# EAGLE design ETAG_v6 (EAGLE 7.5.0)

## Sheet 1 of 2
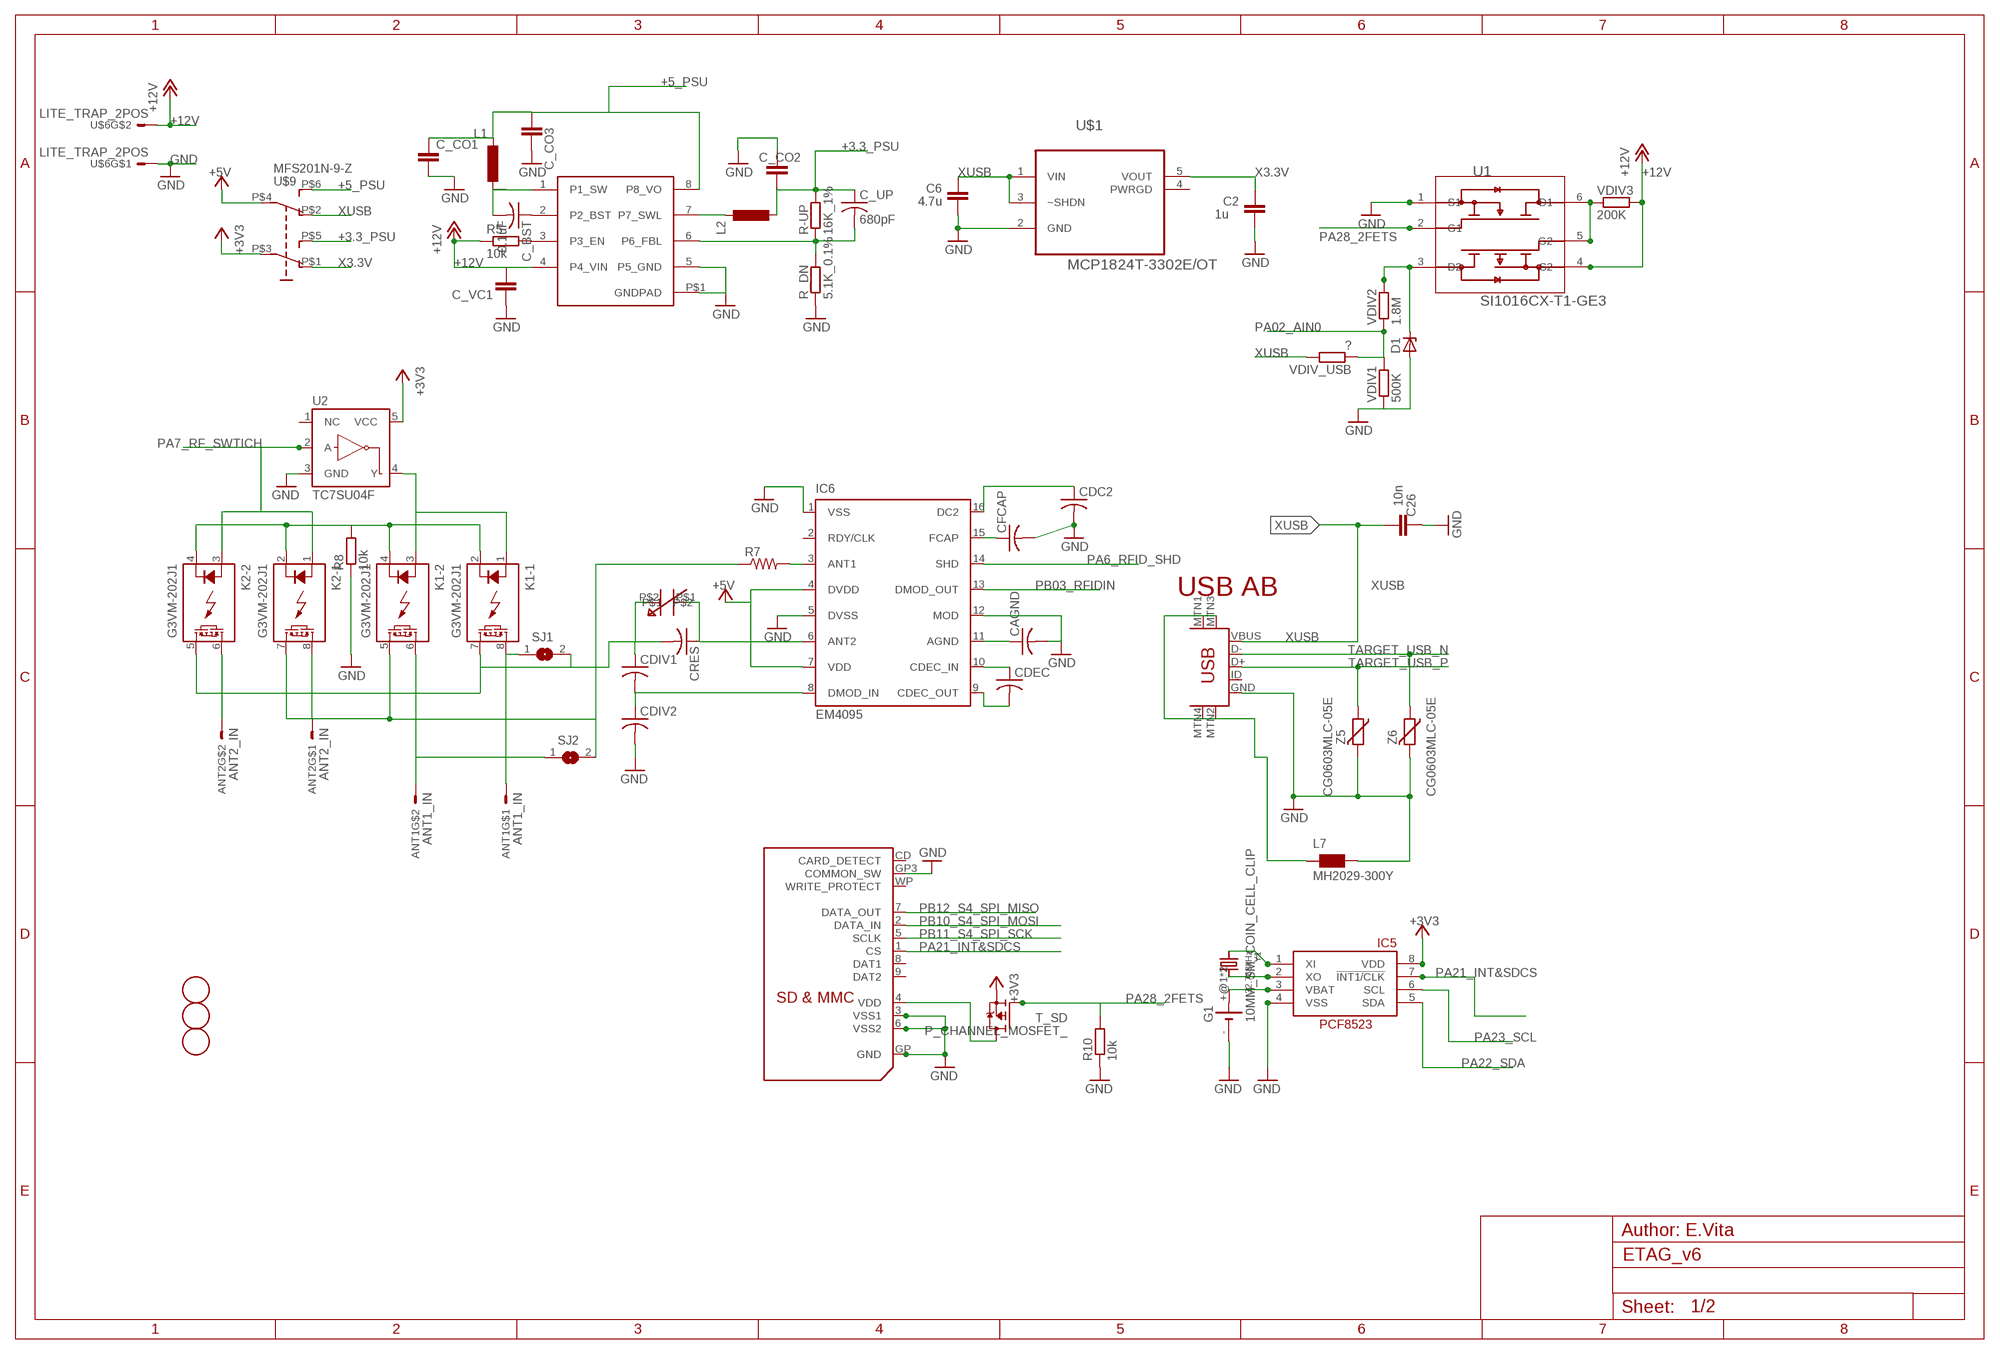
[diagram p0: schematic, sheet 1]

### Parts
ANT1  ANT1_IN  LITE_TRAP_2POS  [LITE_TRAP_MINI]
ANT2  ANT2_IN  LITE_TRAP_2POS  [LITE_TRAP_MINI]
C2  1u  0142_10NF_0603  [C0603-ROUND]
C6  4.7u  0142_10NF_0603  [C0603-ROUND]
C26  10n  0142_10NF_0603  [C0603-ROUND]
C_BST  0.1uF  C-US  [C0603-ROUND]
C_CO1  22uF  C-EUC0805  [C0805]
C_CO2  22uF  C-EUC0805  [C0805]
C_CO3  10uF  C-EUC0805  [C0805]
C_UP  680pF  C-US  [C0603-ROUND]
C_VC1  10uF  C-EUC1210  [C1210]
CAGND  C-US  [C0603-ROUND]
CDC2  C-US  [C0603-ROUND]
CDEC  C-US  [C0603-ROUND]
CDIV1  C-USC1206K  [C1206K]
CDIV2  C-USC1206K  [C1206K]
CFCAP  C-US  [C0603-ROUND]
CRES  C-USC1206K  [C1206K]
D1  ZENER-DIODESOD123  [SOD123FL]
FD1  FIDUCIALMOUNT  [FIDUCIA-MOUNT]
FD2  FIDUCIALMOUNT  [FIDUCIA-MOUNT]
FD3  FIDUCIALMOUNT  [FIDUCIA-MOUNT]
G1  10MM_SM_COIN_CELL_CLIP  [10MM_SM_COIN_CELL_CLIP]
IC5  RTC_PCF8523T  [SOIC8_150MIL]
IC6  EM4095  [SO16]
K1  G3VM-202J1  AQW21SOP  [SOP08]
K2  G3VM-202J1  AQW21SOP  [SOP08]
L1  22uH  L-EUSLF_10MM  [SLF10165]
L2  2.2uH  L-EU1008  [L1008(2520METRIC)]
L7  MH2029-300Y  0001_BLM21PG300SN1D_/_MH2029-300Y  [0805]
R5  10k  0028_CR0603JW103L  [R0603-ROUND]
R7  R-US_R1206  [R1206]
R8  10k  0028_CR0603JW103L  [R0603-ROUND]
R10  10k  0028_CR0603JW103L  [R0603-ROUND]
R-UP  16K_1%  2022_CR0603FW104L  [R0603-ROUND]
R_DN  5.1K_0.1%  2339_  [R0603-ROUND]
SJ1  SJW  [SJW]
SJ2  SJW  [SJW]
T_SD  P_CHANNEL_MOSFET_  [SOT23]
U1  SI1016CX-T1-GE3  [SOT50P162X60-6N]
U2  TC7SU04F  INVERTER_SOT23-5  [SOT23-5]
U$1  MCP1824T-3302E/OT  [SOT95P270X145-5N]
U$3  BD93291EFJSOP8_W_GND  [SOP08_GNDPAD]
U$4  SDMMC06132  [06132]
U$5  USB-MINIB-5PIN  [USB-MINIB]
U$6  LITE_TRAP_2POS  [LITE_TRAP_MINI]
U$9  MFS201N-9-Z  [MFS201N-9-Z]
VAR_C  TZB4Z100AB10R00  [TZB4Z100AB10R00]
VDIV1  500K  2339_  [R0603-ROUND]
VDIV2  1.8M  2022_CR0603FW104L  [R0603-ROUND]
VDIV3  200K  2022_CR0603FW104L  [R0603-ROUND]
VDIV_USB  ?  2339_  [R0603-ROUND]
Y1  32.768kHz  CRYSTAL8.0X3.8  [CRYSTAL_8X3.8]
Z5  CG0603MLC-05E  0010_BRNCG0603MLC-05E  [CT/CN0603]
Z6  CG0603MLC-05E  0010_BRNCG0603MLC-05E  [CT/CN0603]

### Nets
2GND [gnd]: L7.1 U$5.MTN1(MTN2) U$5.MTN2(MTN3) U$5.MTN3(MTN1) U$5.MTN4
+3.3_PSU: C_CO2.2 C_UP.1 L2.2 R-UP.2 U$9.P$5(S)
+3V3: IC5.8(VDD) T_SD.2(S) U2.5(VCC) U$9.P$3(P) ; also sheet 2
+5_PSU [usbvcc]: C_CO1.1 C_CO3.1 L1.P$1 U$3.8(P8_VO) U$9.P$6(S1)
+5V [usbvcc]: IC6.4(DVDD) IC6.7(VDD) U$9.P$4(P1) ; also sheet 2
+12V: C_VC1.2 R5.1 U1.4(S2) U$3.4(P4_VIN) U$6.P$3 U$6.P$4 VDIV3.2 ; also sheet 2
GND [gnd]: C2.1 C6.1 C26.2 C_CO1.2 C_CO2.1 C_CO3.2 C_VC1.1 CAGND.2 CDC2.2 CDIV2.2 CFCAP.2 D1.A G1.- IC5.4(VSS) IC6.1(VSS) IC6.5(DVSS) IC6.12(MOD) L7.2 R8.1 R10.1 R_DN.1 U1.1(S1) U2.3(GND) U$1.2(GND) U$3.5(P5_GND) U$3.P$1(GNDPAD) U$4.3(VSS1) U$4.6(VSS2) U$4.GP3(COMMON_SW) U$4.GP(GND) U$5.GND U$6.P$1 U$6.P$2 VDIV1.1 Z5.2 Z6.2 ; also sheet 2
N$2: IC5.2(XO) Y1.P$4
N$3: IC5.1(XI) Y1.P$1
N$4: CFCAP.1 IC6.15(FCAP)
N$5: CAGND.1 IC6.11(AGND)
N$6: C_BST.1 U$3.2(P2_BST)
N$7: C_UP.2 R-UP.1 R_DN.2 U$3.6(P6_FBL)
N$8: R5.2 U$3.3(P3_EN)
N$9: K1.5(-2:D2) K2.7(-1:D2) R7.1 SJ2.2
N$11: CDIV1.1 CRES.2 K1.7(-1:D2) K2.5(-2:D2) SJ1.2 VAR_C.P$2
N$12: CRES.1 IC6.6(ANT2) VAR_C.P$1
N$13: CDIV1.2 CDIV2.1 IC6.8(DMOD_IN)
N$14: ANT1.P$1 ANT1.P$2 K1.8(-1:D1) SJ1.1
N$15: U1.5(G2) U1.6(D1) VDIV3.1
N$16: ANT2.P$1 ANT2.P$2 K2.8(-1:D1)
N$17: CDC2.1 IC6.16(DC2)
N$18: CDEC.2 IC6.9(CDEC_OUT)
N$19: CDEC.1 IC6.10(CDEC_IN)
N$20: IC6.3(ANT1) R7.2
N$21: D1.C U1.3(D2) VDIV2.2
N$22 [gnd]: K1.2(-1:K) K1.4(-2:K) K2.2(-1:K) K2.4(-2:K) R8.2
N$26: L2.1 U$3.7(P7_SWL)
N$27: C_BST.2 L1.P$2 U$3.1(P1_SW)
N$30: ANT2.P$3 ANT2.P$4 K2.6(-2:D1)
N$32: K1.1(-1:A) K1.3(-2:A) U2.4(Y)
N$35: ANT1.P$3 ANT1.P$4 K1.6(-2:D1) SJ2.1
PA02_AIN0: VDIV1.2 VDIV2.1 VDIV_USB.1 ; also sheet 2
PA6_RFID_SHD: IC6.14(SHD)
PA7_RF_SWTICH: K2.1(-1:A) K2.3(-2:A) U2.2(A) ; also sheet 2
PA21_INT&SDCS: IC5.7(!INT1/CLK) U$4.1(CS) ; also sheet 2
PA22_SDA: IC5.5(SDA) ; also sheet 2
PA23_SCL: IC5.6(SCL) ; also sheet 2
PA28_2FETS: R10.2 T_SD.1(G) U1.2(G1) ; also sheet 2
PB03_RFIDIN: IC6.13(DMOD_OUT) ; also sheet 2
PB10_S4_SPI_MOSI: U$4.2(DATA_IN) ; also sheet 2
PB11_S4_SPI_SCK: U$4.5(SCLK) ; also sheet 2
PB12_S4_SPI_MISO: U$4.7(DATA_OUT) ; also sheet 2
TARGET_USB_N [USBpair]: U$5.D- Z6.1 ; also sheet 2
TARGET_USB_P [USBpair]: U$5.D+ Z5.1 ; also sheet 2
VBAT1: G1.+@1(+) G1.+@2(+) IC5.3(VBAT)
VDD: T_SD.3(D) U$4.4(VDD)
X3.3V: C2.2 U$1.5(VOUT) U$9.P$1(O)
XUSB [usbvcc]: C6.2 C26.1 U$1.1(VIN) U$1.3(~SHDN) U$5.VBUS U$9.P$2(O1) VDIV_USB.2
Unconnected: IC6.2(RDY/CLK) U2.1(NC) U$1.4(PWRGD) U$4.8(DAT1) U$4.9(DAT2) U$4.CD(CARD_DETECT) U$4.WP(WRITE_PROTECT) U$5.ID

### Notes on the sheet
- USB AB
- Author: E.Vita

## Sheet 2 of 2
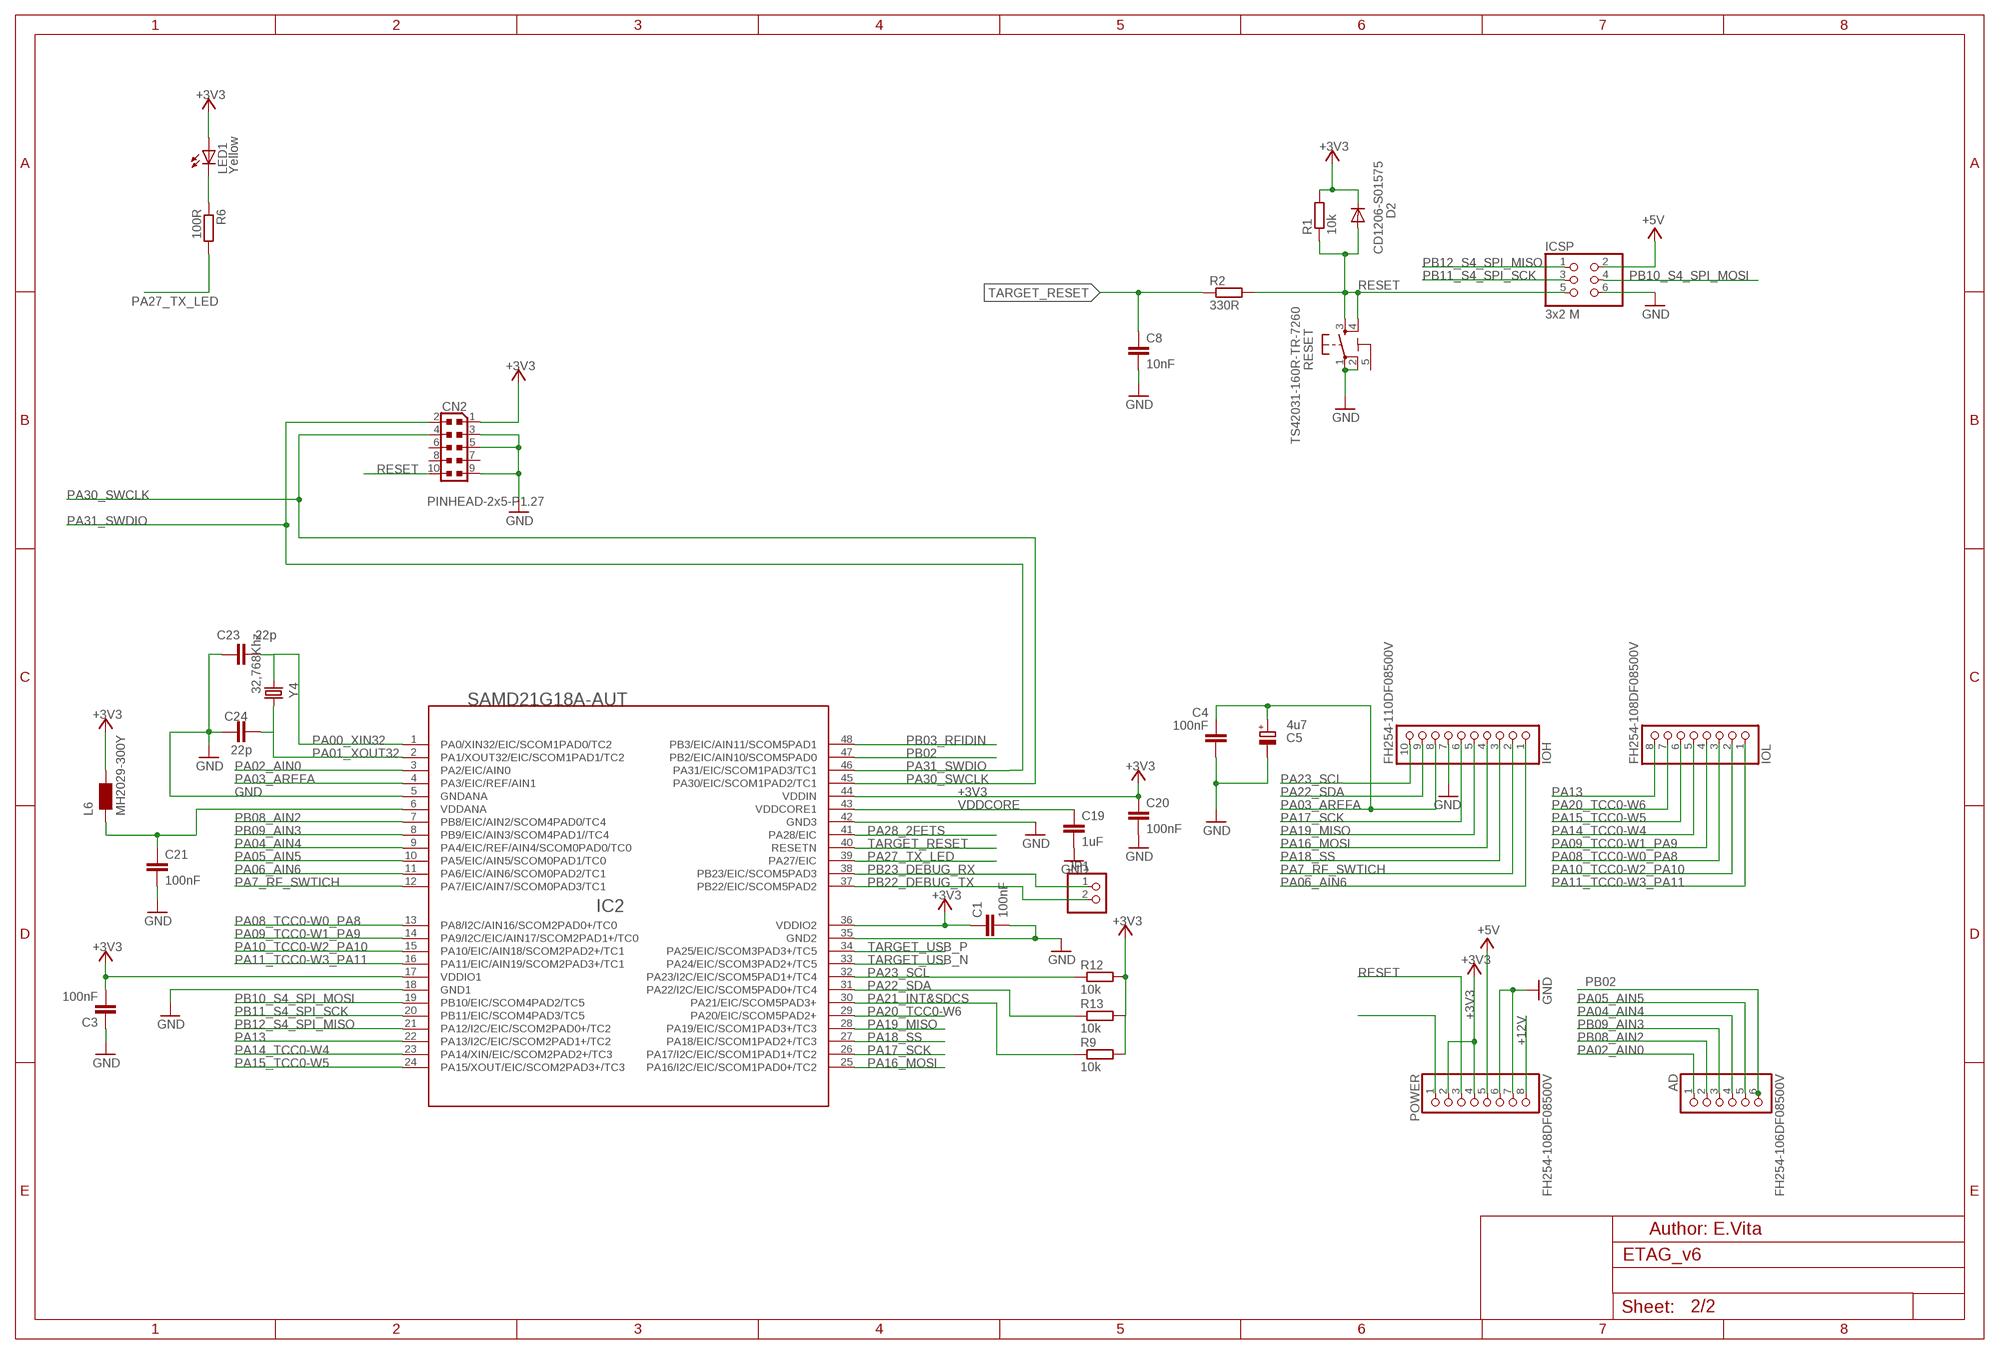
[diagram p1: schematic, sheet 2]

### Parts
AD  FH254-106DF08500V  1682_20TW-535_STD  [1X06]
C1  100nF  0015_100NF_0603  [C0603-ROUND]
C3  100nF  0015_100NF_0603  [C0603-ROUND]
C4  100nF  0015_100NF_0603  [C0603-ROUND]
C5  4u7  0474_TAJA475M016RNJ  [SMC_A]
C8  10nF  0142_10NF_0603  [C0603-ROUND]
C19  1uF  0006_1UF_0603/GRM188R61E105KA12D  [C0603-ROUND]
C20  100nF  0015_100NF_0603  [C0603-ROUND]
C21  100nF  0015_100NF_0603  [C0603-ROUND]
C23  22p  0014_22PF_0603  [C0603-ROUND]
C24  22p  0014_22PF_0603  [C0603-ROUND]
CN2  PINHEAD-2x5-P1.27  0171_PH127-205DF055G00AROUND-PADS  [PINHEAD_2X05_127]
D2  CD1206-S01575  0012_CD1206-S01575  [MINIMELF]
IC2  SAMD21G18A-AUT  1792_SAMD21G18A-AUT  [TQFP48-7X7]
ICSP  3x2 M  0114_PH254-203DF118A00V  [2X03]
IOH  FH254-110DF08500V  1684_20TW-537  [1X10]
IOL  FH254-108DF08500V  1683_20TW-536  [1X08]
JP1  PINHD-1X2  [1X02]
L6  MH2029-300Y  0001_BLM21PG300SN1D_/_MH2029-300Y  [0805]
LED1  Yellow  0044_KPT-2012YC  [CHIPLED_0805]
POWER  FH254-108DF08500V  1683_20TW-536  [1X08]
R1  10k  0028_CR0603JW103L  [R0603-ROUND]
R2  330R  0049_330R_0603  [R0603-ROUND]
R6  100R  0233_0R_0603  [R0603-ROUND]
R9  10k  0028_CR0603JW103L  [R0603-ROUND]
R12  10k  0028_CR0603JW103L  [R0603-ROUND]
R13  10k  0028_CR0603JW103L  [R0603-ROUND]
RESET  TS42031-160R-TR-7260  0946_TS42031-160W-TR-7260  [TS42]
Y4  32,768Khz  0213_ABS07-32.768KHZ-T  [RESONATOR_EPSON_FC_145]

### Nets
+3V3: C1.1 C3.2 C20.1 CN2.1 D2.C IC2.17(VDDIO1) IC2.36(VDDIO2) IC2.44(VDDIN) L6.2 LED1.A POWER.2 POWER.4 R1.2 R9.2 R12.2 R13.2 ; also sheet 1
+5V [usbvcc]: ICSP.2 POWER.5 ; also sheet 1
+12V: POWER.8 ; also sheet 1
GND [gnd]: C1.2 C3.1 C4.2 C5.- C8.2 C19.2 C20.2 C21.2 C23.1 C24.1 CN2.3 CN2.5 CN2.9 IC2.5(GNDANA) IC2.18(GND1) IC2.35(GND2) IC2.42(GND3) ICSP.6 IOH.7 POWER.6 POWER.7 RESET.1 RESET.2 ; also sheet 1
N$1: LED1.C R6.1
N$10: C21.1 IC2.6(VDDANA) L6.1
N$56: POWER.1
PA00_XIN32: C23.2 IC2.1(PA0/XIN32/EIC/SCOM1PAD0/TC2) Y4.P$1
PA01_XOUT32: C24.2 IC2.2(PA1/XOUT32/EIC/SCOM1PAD1/TC2) Y4.P$2
PA02_AIN0: AD.1 IC2.3(PA2/EIC/AIN0) ; also sheet 1
PA03_AREFA: C4.1 C5.+ IC2.4(PA3/EIC/REF/AIN1) IOH.8
PA04_AIN4: AD.4 IC2.9(PA4/EIC/REF/AIN4/SCOM0PAD0/TC0)
PA05_AIN5: AD.5 IC2.10(PA5/EIC/AIN5/SCOM0PAD1/TC0)
PA06_AIN6: IC2.11(PA6/EIC/AIN6/SCOM0PAD2/TC1) IOH.1
PA7_RF_SWTICH: IC2.12(PA7/EIC/AIN7/SCOM0PAD3/TC1) IOH.2 ; also sheet 1
PA08_TCC0-W0_PA8: IC2.13(PA8/I2C/AIN16/SCOM2PAD0+/TC0) IOL.3
PA09_TCC0-W1_PA9: IC2.14(PA9/I2C/EIC/AIN17/SCOM2PAD1+/TC0) IOL.4
PA10_TCC0-W2_PA10: IC2.15(PA10/EIC/AIN18/SCOM2PAD2+/TC1) IOL.2
PA11_TCC0-W3_PA11: IC2.16(PA11/EIC/AIN19/SCOM2PAD3+/TC1) IOL.1
PA13: IC2.22(PA13/I2C/EIC/SCOM2PAD1+/TC2) IOL.8
PA14_TCC0-W4: IC2.23(PA14/XIN/EIC/SCOM2PAD2+/TC3) IOL.5
PA15_TCC0-W5: IC2.24(PA15/XOUT/EIC/SCOM2PAD3+/TC3) IOL.6
PA16_MOSI: IC2.25(PA16/I2C/EIC/SCOM1PAD0+/TC2) IOH.4
PA17_SCK: IC2.26(PA17/I2C/EIC/SCOM1PAD1+/TC2) IOH.6
PA18_SS: IC2.27(PA18/EIC/SCOM1PAD2+/TC3) IOH.3
PA19_MISO: IC2.28(PA19/EIC/SCOM1PAD3+/TC3) IOH.5
PA20_TCC0-W6: IC2.29(PA20/EIC/SCOM5PAD2+) IOL.7
PA21_INT&SDCS: IC2.30(PA21/EIC/SCOM5PAD3+) R9.1 ; also sheet 1
PA22_SDA: IC2.31(PA22/I2C/EIC/SCOM5PAD0+/TC4) IOH.9 R13.1 ; also sheet 1
PA23_SCL: IC2.32(PA23/I2C/EIC/SCOM5PAD1+/TC4) IOH.10 R12.1 ; also sheet 1
PA27_TX_LED: IC2.39(PA27/EIC) R6.2
PA28_2FETS: IC2.41(PA28/EIC) ; also sheet 1
PA30_SWCLK: CN2.4 IC2.45(PA30/EIC/SCOM1PAD2/TC1)
PA31_SWDIO: CN2.2 IC2.46(PA31/EIC/SCOM1PAD3/TC1)
PB02: AD.6 IC2.47(PB2/EIC/AIN10/SCOM5PAD0)
PB03_RFIDIN: IC2.48(PB3/EIC/AIN11/SCOM5PAD1) ; also sheet 1
PB08_AIN2: AD.2 IC2.7(PB8/EIC/AIN2/SCOM4PAD0/TC4)
PB09_AIN3: AD.3 IC2.8(PB9/EIC/AIN3/SCOM4PAD1//TC4)
PB10_S4_SPI_MOSI: IC2.19(PB10/EIC/SCOM4PAD2/TC5) ICSP.4 ; also sheet 1
PB11_S4_SPI_SCK: IC2.20(PB11/EIC/SCOM4PAD3/TC5) ICSP.3 ; also sheet 1
PB12_S4_SPI_MISO: IC2.21(PA12/I2C/EIC/SCOM2PAD0+/TC2) ICSP.1 ; also sheet 1
PB22_DEBUG_TX: IC2.37(PB22/EIC/SCOM5PAD2) JP1.2
PB23_DEBUG_RX: IC2.38(PB23/EIC/SCOM5PAD3) JP1.1
RESET: CN2.10 D2.A ICSP.5 POWER.3 R1.1 R2.2 RESET.3 RESET.4
TARGET_RESET: C8.1 IC2.40(RESETN) R2.1
TARGET_USB_N [USBpair]: IC2.33(PA24/EIC/SCOM3PAD2+/TC5) ; also sheet 1
TARGET_USB_P [USBpair]: IC2.34(PA25/EIC/SCOM3PAD3+/TC5) ; also sheet 1
VDDCORE: C19.1 IC2.43(VDDCORE1)
Unconnected: CN2.6 CN2.7 CN2.8

### Notes on the sheet
- Author: E.Vita

## Power pins joined to a net without a drawn wire
5-GND: RESET.5(5-GND)

## Library data of the parts
AD = Connettori:1682_20TW-535: Female Gray Connector strip for Arduino 3V3 bases - 6x1 F V h 8,5 p2,54; MONTHLY_USAGE: 86722.85; PART_NUMBER: 20TW-535; PRICE: _0.03; SUPPLIER: CBC_elettronica__s.r.l.; TYPE: Connettori
ANT1 ANT2 U$6 = con-molex:LITE_TRAP_2POS
C1 C3 C4 C20 C21 = Condensatori:0015_100NF_0603: 100nF 0603 50V; CASE: 0603; MONTHLY_USAGE: _____; PART_NUMBER: cl10b104kbnc; PRICE: _____; SUPPLIER: _____; TYPE: Condensatori
C2 C6 C26 = Condensatori:0142_10NF_0603: 10nF 0603; CASE: 0603; MONTHLY_USAGE: _____; PART_NUMBER: 10nF_0603; PRICE: _____; SUPPLIER: _____; TYPE: Condensatori; VALUE: 10nF
C5 = Condensatori:0474_TAJA475M016RNJ: 4u7 tantalio Case A - testa gialla -Tantalio; CASE: CaseA_(1206); MONTHLY_USAGE: _____; PART_NUMBER: TAJA475M016RNJ; PRICE: _____; SUPPLIER: _____; TYPE: Condensatori
C8 = Condensatori:0142_10NF_0603: 10nF 0603; CASE: 0603; MONTHLY_USAGE: _____; PART_NUMBER: 10nF_0603; PRICE: _____; SUPPLIER: _____; TYPE: Condensatori
C19 = Condensatori:0006_1UF_0603/GRM188R61E105KA12D: 1uF 0603; CASE: 0603; MONTHLY_USAGE: _____; PART_NUMBER: 1uF_0603/GRM188R61E105KA12D; PRICE: _____; SUPPLIER: _____; TYPE: Condensatori
C23 C24 = Condensatori:0014_22PF_0603: 22pF 0603; CASE: 0603; MONTHLY_USAGE: _____; PART_NUMBER: 22pF_0603; PRICE: _____; SUPPLIER: _____; TYPE: Condensatori
C_BST C_UP CAGND CDC2 CDEC CDIV1 CDIV2 CFCAP CRES = rcl:C-US: CAPACITOR, American symbol
C_CO1-C_CO3 C_VC1 = rcl:C-EU: CAPACITOR, European symbol
CN2 = Connettori:0171_PH127-205DF055G00A: 2x5 PASSO 1,27
D1 = diode:ZENER-DIODE: Z-Diode
D2 = Diodi:0012_CD1206-S01575: small-signal high-speed Switching Diodes CD1206; CASE: 1206; MONTHLY_USAGE: _____; PART_NUMBER: CD1206-S01575; PRICE: _____; SUPPLIER: _____; TYPE: Diodi
FD1-FD3 = SmartPrj:FIDUCIALMOUNT
G1 = battery:10MM_SM_COIN_CELL_CLIP: Battery cell clip for CR927 Source: KEYSTONE ELECTRONICS CORP. www.keyelco.com, ASTORIA, N.Y. 11105-2017 PART ANME 10mm SM COIN CELl CLIP DWG NO. 3030
IC2 = IntegratedCircuits:1792_SAMD21G18A-AUT: Atmel D21 32bit ARM Cortex-M0 microcontroller - 48 PIN TQFP 256KB flash memory + 32KB SRAM
IC5 = microbuilder:RTC_PCF8523
IC6 = em-microelectronic:EM4095: Read/Write analog front end for 125kHz RFID Basestation Source: http://www.emmicroelectronic.com/webfiles/Product/RFID/DS/EM4095_DS.pdf
ICSP = Connettori:0114_PH254-203DF118A00V: 3x2 M V h 8,5 mm p2,54; MONTHLY_USAGE: _____; PART_NUMBER: PH254-203DF118A00V; PRICE: _____; SUPPLIER: _____; TYPE: Connettori; VALUE: ICSP
IOH = Connettori:1684_20TW-537: Female Gray Connector strip for Arduino 3V3 bases - 10x1 F V h 8,5 p2,54mm; MONTHLY_USAGE: _____; PART_NUMBER: 20TW-537; PRICE: _____; SUPPLIER: _____; TYPE: Connettori
IOL POWER = Connettori:1683_20TW-536: Female Gray Connector strip for Arduino 3V3 bases - 8x1 F V h 8,5 p2,54mm; MONTHLY_USAGE: _____; PART_NUMBER: 20TW-536; PRICE: _____; SUPPLIER: _____; TYPE: Connettori
JP1 = pinhead:PINHD-1X2: PIN HEADER
K1 K2 = relay:AQW*: PhotoMOS Relay NAiS Source: http://www.mew-europe.com/.. pti_en.pdf; OC_FARNELL: unknown; OC_NEWARK: unknown
L1 L2 = rcl:L-EU: INDUCTOR, European symbol
L6 L7 = Protezione:0001_BLM21PG300SN1D_/_MH2029-300Y: BLM21; MONTHLY_USAGE: _____; PART_NUMBER: BLM21PG300SN1D_/_MH2029-300Y; PRICE: _____; SUPPLIER: _____; TYPE: Protezione
LED1 = Opto:0044_KPT-2012YC: LED YELLOW - SMD - 0805; MONTHLY_USAGE: _____; PART_NUMBER: KPT-2012YC; PRICE: _____; SUPPLIER: _____; TYPE: Opto
R1 R5 R8-R10 R12 R13 = Resistenze:0028_CR0603JW103L: 10K 0603; CASE: 0603; MONTHLY_USAGE: _____; PART_NUMBER: CR0603JW103L; PRICE: _____; SUPPLIER: _____; TYPE: Resistenze
R2 = Resistenze:0049_330R_0603: 330R 0603; CASE: 0603; MONTHLY_USAGE: _____; PART_NUMBER: 330R_0603; PRICE: _____; SUPPLIER: _____; TYPE: Resistenze
R6 = Resistenze:0233_0R_0603: 0R 0603; CASE: 0603; MONTHLY_USAGE: _____; PART_NUMBER: 0R_0603; PRICE: _____; SUPPLIER: _____; TYPE: Resistenze; VALUE: 0R
R7 = rcl:R-US_: RESISTOR, American symbol
R-UP VDIV2 VDIV3 = Resistenze:2022_CR0603FW104L: 0603 Resistor 100K 1%; PART_NUMBER: CR0603FW104L; VALUE: 100K_1%
R_DN VDIV1 VDIV_USB = Resistenze:2339_: 19K1 0,1% 0603; CASE: 0603; MONTHLY_USAGE: _____; PRICE: _____; SUPPLIER: _____; TYPE: Resistenze; VALUE: 19K1_0,1%
RESET = Switches:0946_TS42031-160W-TR-7260: Pushbutton 6x6 Smd - White; MONTHLY_USAGE: _____; PART_NUMBER: IT-1157AHNP-160G-G_GTR; PRICE: _____; SUPPLIER: _____; TYPE: Switches; VALUE: TS42
SJ1 SJ2 = jumper:SJ: SMD solder JUMPER
T_SD = transistor-fet:P_CHANNEL_MOSFET_
U1 = Vishay_By_element14_Batch_1:SI1016CX-T1-GE3: Complementary N- and P-Channel 20 V (D-S) MOSFET; MPN: SI1016CX-T1-GE3; OC_FARNELL: 2056711; OC_NEWARK: 64T4049; PACKAGE: SOT-5; SUPPLIER: VISHAY SILICONIX
U2 = SparkFun-DigitalIC:INVERTER: Single inverter, SOT23-5; NOTE: RETIRED; PROD_ID: 8211
U$1 = Microchip_By_element14_Batch_1:MCP1824T-3302E/OT: 300 mA, Low Voltage, Low Quiescent Current LDO Regulator; MPN: MCP1824T-3302E/OT; OC_FARNELL: 1578387; OC_NEWARK: 40M0704; PACKAGE: SOT23-5; SUPPLIER: Microchip
U$3 = v-reg:BD93291EFJ: BD93291EFJ Voltage regulator
U$4 = microbuilder:SDMMC: SD MMC Card holder 4UCON part #06132 - easy to solder
U$5 = USB_miniB:USB-MINIB
U$9 = switch:MFS201N-9-Z
VAR_C = mylibrary:TZB4Z100AB10R00
Y1 = microbuilder:CRYSTAL: Crystals HC49UP - Surface Mount Crystal 4.0MHz 18pF +/-30ppm Surface Mount Crystal [Digikey: 535-9857-1-ND] 12.0 MHz Surface Mount Crystal [Digikey: 535-9869-6-ND] 25.0 MHz Surface Mount Crystal [Digikey: 535-9078-1-ND] 2.5 x 2.0mm - MEMs SMT Crystal 16.0 MHz 10pF 20ppm 2.5 x 2.0mm Crystal [Digikey -40-85°C: 535-10923-1-ND] 3.2 x 2.5mm - MEMs SMT Crystal 12.0 MHz 8pF 15ppm 3.2 x 2.5mm Crystal [Digikey: -10-70°C: 644-1047-1-ND -40-125°C: 644-1128-1-ND] 40~85°C cheaper: 644-1173-6-ND 16.0 MHz 8pF 15ppm 3.2 x 2.5mm Crystal [Digikey: -10-70°C: 644-1049-1-ND -40-125°C: 644-1129-2-ND]-40~85°C cheaper: 644-1175-6-ND 16.0 MHz 10pF 10ppm 3.2 x 2.5mm Crystal [Digikey: 644-1100-1-ND] 27.12 MHz 18pF 30ppm 3.2 x 2.5mm Crystal [Digikey: 887-1424-1-ND] 27.12MHz 10pF 10ppm 3.2 x 2.5mm Crystal [Digikey: 887-1329-1-ND] 4.9 x 1.8mm - MEMs SMT Crystal 32.768 KHz 12.5pF 20ppm 4.9 x 1.8mm Crystal [Digikey: SE2415CT-ND] 8.0 x 3.8mm - Surface Mount Crystal 32.768kHz 12.5pF 20ppm -40°C-85°C [Digikey: 535-9166-2-ND] Cylinder 32.768KHz Cylinder Crystal (2x6mm body) [Ex. Digikey: 300-8341-2-ND]
Y4 = Cristalli:0213_ABS07-32.768KHZ-T: 32,768KHz - SMD; MONTHLY_USAGE: _____; PART_NUMBER: ABS07-32.768KHZ-T; PRICE: _____; SUPPLIER: _____; TYPE: Cristalli; VALUE: 32,768Khz_SMD
Z5 Z6 = Protezione:0010_BRNCG0603MLC-05E: CG0603MLC-05E; MONTHLY_USAGE: _____; PART_NUMBER: BRNCG0603MLC-05E; PRICE: _____; SUPPLIER: _____; TYPE: Protezione; VALUE: BRNCG0603MLC-05E

## Net classes
1 USB: width 0.203 mm, drill 0.305 mm, clearance 0.178 mm
2 gnd: width 0.254 mm, drill 0.254 mm, clearance 0.178 mm
3 usbvcc: width 0.203 mm, drill 0.406 mm, clearance 0.178 mm
4 USBpair: width 0.254 mm, drill 0.406 mm, clearance 0.406 mm

## Board
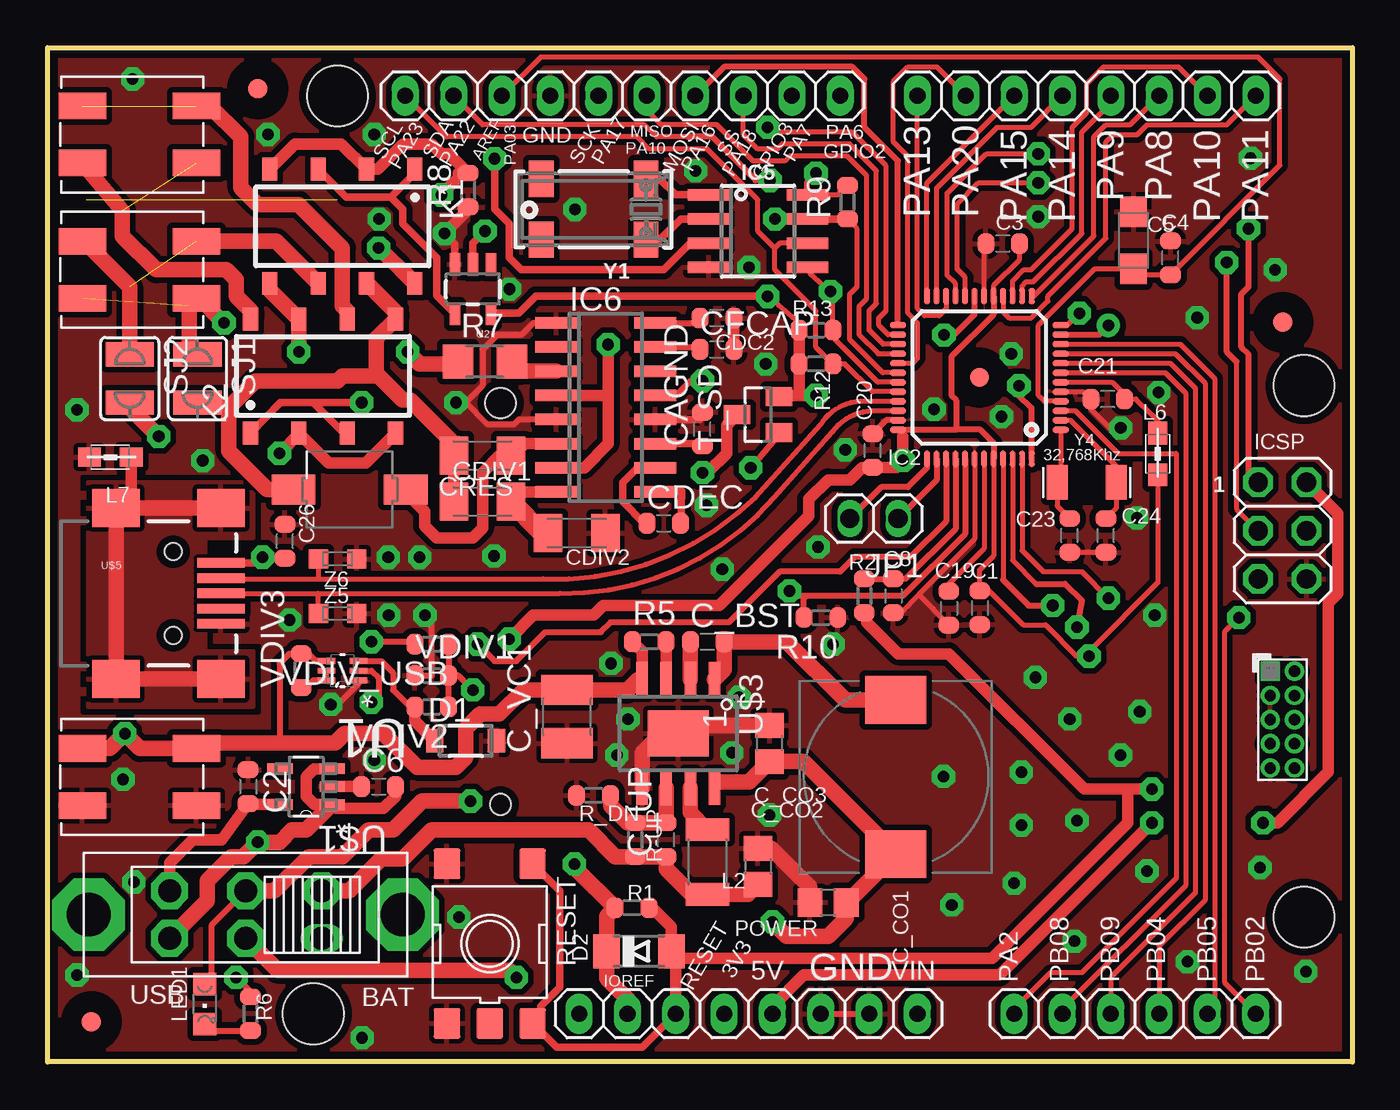
[diagram p2: board, top side]
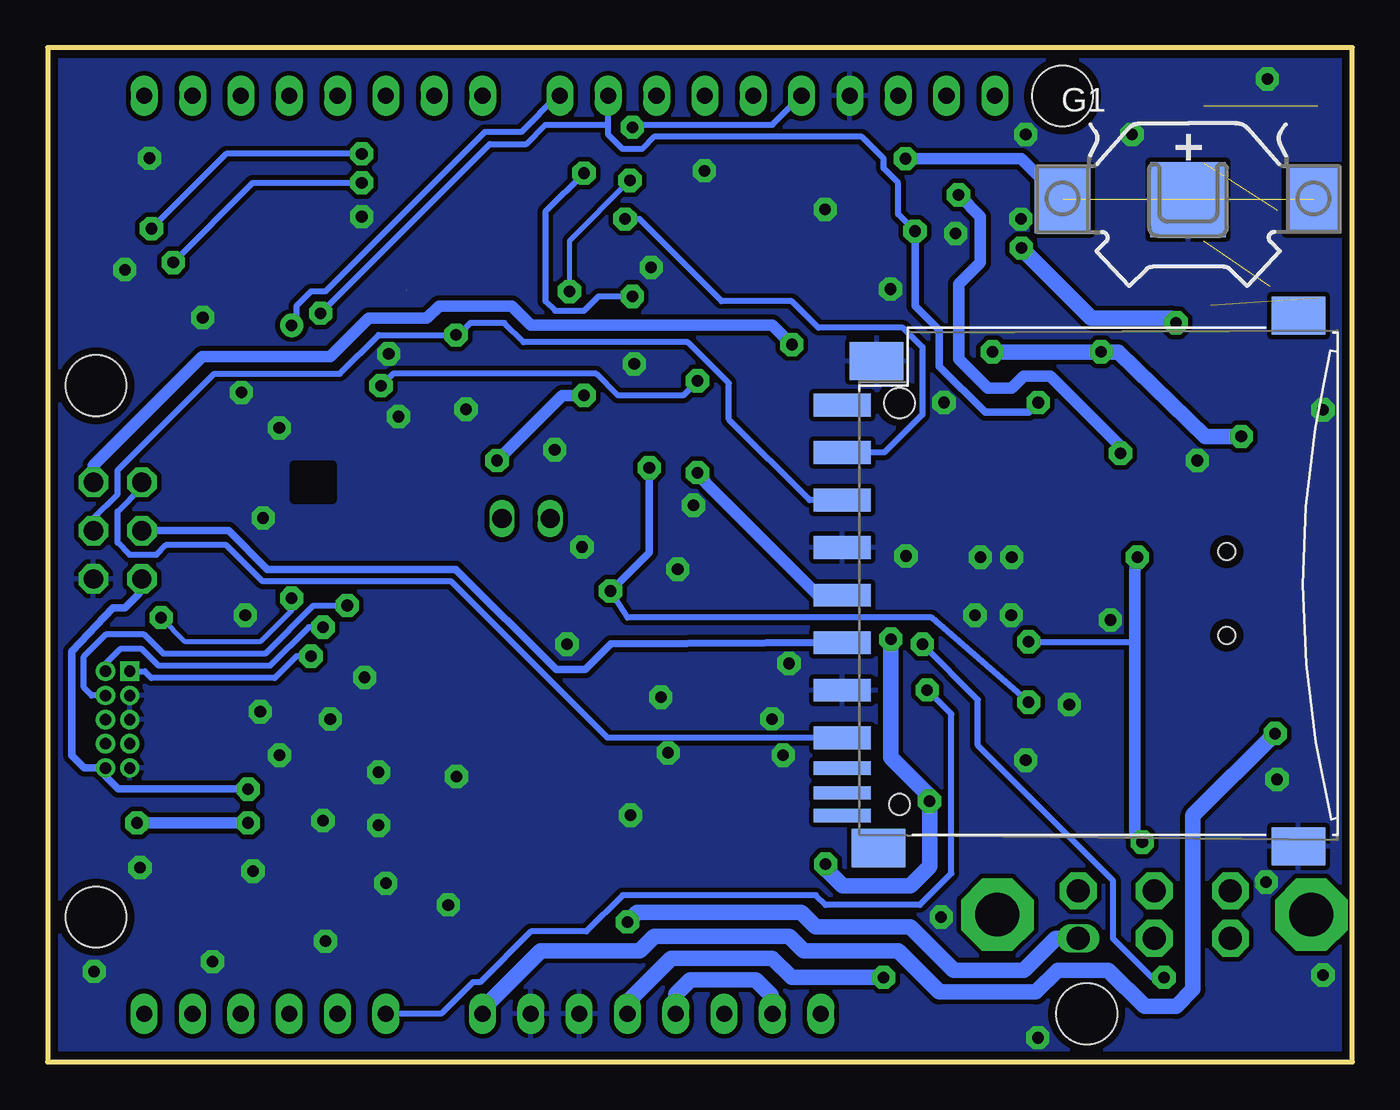
[diagram p3: board, bottom side, seen from below]

Size 68.58 x 53.34 mm. Coordinates in mm from the lower left corner, seen from the top.
Outline: 68.58,53.34 68.58,0 0,0 0,53.34 68.58,53.34
Copper layers (1*2+15*16): Top 0.035mm / dielectric 0.5mm / layer 2 0.035mm / dielectric 0.4mm / layer 15 0.035mm / dielectric 0.5mm / Bottom 0.035mm
Design rules "ArduinoUno *": minimum track width 6mil, minimum drill 16mil, track to track 7mil, track to pad 7mil, pad to pad 7mil, via to via 7mil, smd to smd 4mil, copper to edge 16mil, drill to drill 10mil, minimum pad ring 6mil, minimum via ring 4.5mil, stop-mask expansion 1mil, vias tented up to drill 32mil, thermal gap 10mil
Holes 3.2 mm at 66.04,35.56 66.04,7.62 15.24,50.8 13.97,2.54
vRestrict: area 42.2,47.2 to 43.3,48.8; area 48.3,47.5 to 49.5,48.9; area 47.6,47.4 to 48.8,48.9; area 50.2,47.4 to 51.3,48.9; area 44.7,47.2 to 45.8,48.8

### Footprints (pad centres in the part's own frame; a part is rotated, then mirrored left to right if it is on the bottom)
1X06 = drill 0.85 pad 1.422 long: 1 -6.35,0; 2 -3.81,0; 3 -1.27,0; 4 1.27,0; 5 3.81,0; 6 6.35,0
LITE_TRAP_MINI = smd 2.5 x 1.4: P$1 -3,1.5; P$2 3,1.5; P$3 -3,-1.5; P$4 3,-1.5
C0603-ROUND = smd 0.898 x 1.1: 1 -0.889,0; 2 0.889,0
SMC_A = smd 1.6 x 1.4: + -1.5,0; - 1.5,0
C0805 = smd 1.3 x 1.5: 1 -0.95,0; 2 0.95,0
C1210 = smd 1.6 x 2.7: 1 -1.4,0; 2 1.4,0
C1206K = smd 1.5 x 2: 1 -1.5,0; 2 1.5,0
PINHEAD_2X05_127 = drill 0.6 pad 1.016 square: 1 -0.635,2.54 | drill 0.6 pad 1.016: 2 0.635,2.54; 3 -0.635,1.27; 4 0.635,1.27; 5 -0.635,0; 6 0.635,0; 7 -0.635,-1.27; 8 0.635,-1.27; 9 -0.635,-2.54; 10 0.635,-2.54
SOD123FL = smd 0.91 x 1.22: A 1.625,0; C -1.625,0
MINIMELF = smd 1.4 x 1.8: A 1.7,0; C -1.7,0
FIDUCIA-MOUNT = smd 1.016 x 1.016: P$1 0,0
10MM_SM_COIN_CELL_CLIP = smd 2.9 x 3.5: +@1 -6.6,0; +@2 6.6,0 | smd 3.96 x 3.96: - 0,0
TQFP48-7X7 = smd 0.85 x 0.32: 1 -4.275,2.75; 2 -4.275,2.25; 3 -4.275,1.75; 4 -4.275,1.25; 5 -4.275,0.75; 6 -4.275,0.25; 7 -4.275,-0.25; 8 -4.275,-0.75; 9 -4.275,-1.25; 10 -4.275,-1.75; 11 -4.275,-2.25; 12 -4.275,-2.75; 25 4.275,-2.75; 26 4.275,-2.25; 27 4.275,-1.75; 28 4.275,-1.25; 29 4.275,-0.75; 30 4.275,-0.25; 31 4.275,0.25; 32 4.275,0.75; 33 4.275,1.25; 34 4.275,1.75; 35 4.275,2.25; 36 4.275,2.75 | smd 0.32 x 0.85: 13 -2.75,-4.275; 14 -2.25,-4.275; 15 -1.75,-4.275; 16 -1.25,-4.275; 17 -0.75,-4.275; 18 -0.25,-4.275; 19 0.25,-4.275; 20 0.75,-4.275; 21 1.25,-4.275; 22 1.75,-4.275; 23 2.25,-4.275; 24 2.75,-4.275; 37 2.75,4.275; 38 2.25,4.275; 39 1.75,4.275; 40 1.25,4.275; 41 0.75,4.275; 42 0.25,4.275; 43 -0.25,4.275; 44 -0.75,4.275; 45 -1.25,4.275; 46 -1.75,4.275; 47 -2.25,4.275; 48 -2.75,4.275 | smd 1 x 1: P$1 0,0
SOIC8_150MIL = smd 0.6 x 2.2: 1 -1.905,-2.6; 2 -0.635,-2.6; 3 0.635,-2.6; 4 1.905,-2.6; 5 1.905,2.6; 6 0.635,2.6; 7 -0.635,2.6; 8 -1.905,2.6
SO16 = smd 0.6 x 2.2: 1 -4.445,-2.6; 2 -3.175,-2.6; 3 -1.905,-2.6; 4 -0.635,-2.6; 5 0.635,-2.6; 6 1.905,-2.6; 7 3.175,-2.6; 8 4.445,-2.6; 9 4.445,2.6; 10 3.175,2.6; 11 1.905,2.6; 12 0.635,2.6; 13 -0.635,2.6; 14 -1.905,2.6; 15 -3.175,2.6; 16 -4.445,2.6
2X03 = drill 1.016 pad 1.55 octagon: 1 -2.54,-1.27; 2 -2.54,1.27; 3 0,-1.27; 4 0,1.27; 5 2.54,-1.27; 6 2.54,1.27
1X10 = drill 0.85 pad 1.422 long: 1 -11.43,0; 2 -8.89,0; 3 -6.35,0; 4 -3.81,0; 5 -1.27,0; 6 1.27,0; 7 3.81,0; 8 6.35,0; 9 8.89,0; 10 11.43,0
1X08 = drill 0.85 pad 1.422 long: 1 -8.89,0; 2 -6.35,0; 3 -3.81,0; 4 -1.27,0; 5 1.27,0; 6 3.81,0; 7 6.35,0; 8 8.89,0
1X02 = drill 1.016 long: 1 -1.27,0; 2 1.27,0
SOP08 = smd 0.8 x 1.2: 1 -3.81,-3; 2 -1.27,-3; 3 1.27,-3; 4 3.81,-3; 5 3.81,3; 6 1.27,3; 7 -1.27,3; 8 -3.81,3
SLF10165 = smd 2.5 x 3.2: P$1 -4.05,0; P$2 4.05,0
L1008(2520METRIC) = smd 1.2 x 2.3: 1 -1.7,0; 2 1.7,0
0805 = smd 1.2 x 1: 1 -1.1,0; 2 1.1,0
CHIPLED_0805 = smd 1.2 x 1.2: A 0,-1.05; C 0,1.05
R0603-ROUND = smd 0.898 x 1.1: 1 -0.889,0; 2 0.889,0
R1206 = smd 1.6 x 1.803: 1 -1.422,0; 2 1.422,0
TS42 = smd 1.6 x 1.4: 1 -4.2,2.25; 2 4.2,2.25; 3 -4.2,-2.25; 4 4.2,-2.25; 5 -4.2,0
SJW = smd 1.27 x 2.54: 1 -1.27,0; 2 1.27,0
SOT23 = smd 1 x 1.4: 1 -0.95,-1.1; 2 0.95,-1.1; 3 0,1.1
SOT50P162X60-6N = smd 0.914 x 0.305: 1 -0.838,0.508; 2 -0.838,0; 3 -0.838,-0.508; 4 0.838,-0.508; 5 0.838,0; 6 0.838,0.508
SOT23-5 = smd 0.55 x 1.2: 1 -0.95,-1.3; 2 0,-1.3; 3 0.95,-1.3; 4 0.95,1.3; 5 -0.95,1.3
SOT95P270X145-5N = smd 1.321 x 0.559: 1 -1.372,0.94; 2 -1.372,0; 3 -1.372,-0.94; 4 1.372,-0.94; 5 1.372,0.94
SOP08_GNDPAD = smd 0.6 x 1.8: 1 -1.905,-2.85; 2 -0.635,-2.85; 3 0.635,-2.85; 4 1.905,-2.85; 5 1.905,2.85; 6 0.635,2.85; 7 -0.635,2.85; 8 -1.905,2.85 | smd 3.2 x 2.4: P$1 0,0
06132 = smd 1.2 x 3: 1 6.9,0.9; 2 4.4,0.9; 3 1.9,0.9; 4 -0.6,0.9; 5 -3.1,0.9; 6 -5.6,0.9; 7 -8.1,0.9; 9 9.4,0.9 | smd 0.7 x 3: 8 -9.7,0.9; CD -11,0.9; WP -12.2,0.9 | smd 2 x 2.8: GP -13.8,-23.07; GP2 14.1,-23.07; GP3 11.7,-0.9; GP4 -13.9,-1 | hole 1.1: -11.6,-2.1 | hole 1.6: 9.5,-2.1
USB-MINIB = smd 2.5 x 0.5: D+ 2.5,0; D- 2.5,0.8; GND 2.5,-1.6; ID 2.5,-0.8; VBUS 2.5,1.6 | smd 2.5 x 2: MTN1 -3,4.5; MTN2 2.5,4.5; MTN3 -3,-4.5; MTN4 2.5,-4.5 | hole 0.9: 0,2.2; 0,-2.2
MFS201N-9-Z = drill 1.2 pad 1.93 octagon: P$1 -4,1.25; P$2 -4,-1.25; P$3 0,1.25; P$4 0,-1.25; P$5 4,1.25 | drill 1.2 pad 1.422 long: P$6 4,-1.25 | drill 2.3 pad 3.81 octagon: P$7 -8.25,0; P$8 8.25,0
TZB4Z100AB10R00 = smd 2.3 x 1.6: P$1 2.95,0; P$2 -2.95,0
CRYSTAL_8X3.8 = smd 1.3 x 1.9: P$1 -2.75,-1.6; P$2 2.75,-1.6; P$3 2.75,1.6; P$4 -2.75,1.6
RESONATOR_EPSON_FC_145 = smd 1.1 x 1.8: P$1 -1.55,0; P$2 1.55,0
CT/CN0603 = smd 1 x 1: 1 -1,0; 2 1,0

### Placement (x,y rotation side)
AD  57.15,2.54 0 top
ANT1  4.83,41.66 180 top
ANT2  4.83,48.77 180 top
C1  48.99,23.88 270 top
C2  10.54,14.48 270 top
C3  50.2,43.03 0 top
C4  59.02,42.28 90 top
C5  57.08,43.2 90 top
C6  17.4,14.48 0 top
C8  44.45,24.51 270 top
C19  47.37,23.86 270 top
C20  43.37,32.15 90 top
C21  55.72,34.86 180 top
C23  53.72,27.69 90 top
C24  55.63,27.69 90 top
C26  12.48,27.38 90 top
C_BST  34.67,22.1 0 top
C_CO1  41.02,8.38 180 top
C_CO2  37.34,10.29 270 top
C_CO3  37.95,16.74 90 top
C_UP  32.51,11.68 90 top
C_VC1  27.3,18.16 90 top
CAGND  34.42,33.27 90 top
CDC2  35.18,39.12 0 top
CDEC  32.38,28.32 0 top
CDIV1  22.86,29.46 0 top
CDIV2  27.81,27.81 0 top
CFCAP  35.18,37.47 0 top
CN2  64.9,18 0 top
CRES  22.86,31.88 180 top
D1  21.97,16.89 0 top
D2  31.08,5.82 0 top
FD1  11.05,51.18 180 top
FD2  2.31,2.13 0 top
FD3  64.92,38.89 0 top
G1  8.64,45.34 0 bottom
IC2  48.97,35.99 180 top
IC5  37.34,43.69 270 top
IC6  29.34,34.42 270 top
ICSP  64.9,27.94 270 top
IOH  30.23,50.8 180 top
IOL  54.61,50.8 180 top
JP1  43.43,28.57 180 top
K1  15.49,43.94 180 top
K2  14.48,36.07 0 top
L1  44.58,14.99 90 top
L2  34.68,10.52 270 top
L6  58.35,31.98 270 top
L7  3.3,31.8 180 top
LED1  8.26,3.05 180 top
POWER  36.83,2.54 0 top
R1  30.71,8.11 180 top
R2  42.93,24.51 270 top
R5  31.62,22.1 0 top
R6  10.67,2.54 90 top
R7  22.99,36.83 0 top
R8  22.1,45.85 90 top
R9  42.04,45.21 90 top
R10  40.64,23.37 180 top
R12  40.39,36.7 180 top
R13  40.39,38.48 180 top
R-UP  30.89,11.68 270 top
R_DN  28.7,14.02 0 top
RESET  23.24,6.22 90 top
SJ1  7.87,35.94 270 top
SJ2  4.32,35.94 270 top
T_SD  37.34,34.04 90 top
U1  15.49,20.57 180 top
U2  22.35,40.64 180 top
U$1  13.59,14.48 180 top
U$3  33.15,17.27 180 top
U$4  25.91,25.15 90 bottom
U$5  6.6,24.64 0 top
U$6  4.83,14.99 180 top
U$9  10.41,7.75 0 top
VAR_C  15.88,30.1 0 top
VDIV1  20.19,20.32 0 top
VDIV2  20.19,18.67 180 top
VDIV3  13.34,20.57 90 top
VDIV_USB  20.19,21.97 180 top
Y1  28.7,44.83 180 top
Y4  54.61,30.48 0 top
Z5  15.24,23.58 0 top
Z6  15.24,26.45 0 top

### Tracks (layer width: path | path; a pad name or v marks a point on that pad's centre or on a via)
2GND
  Top 0.61: L7.1 4.4,29.93 U$5.MTN1
  Top 0.813: U$5.MTN4 9.41,20.07 9.27,20.07 9.2,20.14 U$5.MTN3 U$5.MTN1 U$5.MTN2
  pour Top: 2.16,30.48 10.79,30.48 10.79,27.56 8.26,27.56 8.26,21.59 10.79,21.59 10.79,18.67 2.16,18.67
+3.3_PSU
  Top 0.813: C_CO2.2 36.82,8.82 L2.2 33.86,8.82 32.51,10.16 C_UP.1 R-UP.2 29.84,10.79 28.45,12.19 20.19,12.19 18.67,10.67 17.53,10.67 15.86,9 U$9.P$5
+3V3  (via drill 0.61)  (1 unrouted)
  Top 0.254: IC2.17 49.72,40.58 | L6.2 58.35,25.2 54.74,21.59 v54.74,21.34 54.1,21.34 52.45,22.99 51.28,22.99 49.5,24.77 C1.1 48.99,25.88 49.72,26.61 IC2.44 | IC5.8 41.53,45.59 R9.2 | C20.1 43.03,31.39 | R13.2 39.5,38.86 v37.85,40.26 | 49.73,40.59 49.73,40.84 51.09,42.2 C3.2
  Top 0.305: IC2.17 49.72,39.31 47.5,37.08 47.5,35.05 47.75,34.8 47.75,33.24 | 47.75,33.24 IC2.36 44.96,32.98 44.96,32.89 | IC5.8 39.94,46.29 v40.39,46.74 | 47.75,33.24 49.03,33.24 49.72,32.55 IC2.44 | U$9.P$3 8.64,7.22 8.64,4.48 LED1.A
  Top 0.406: U2.5 23.33,39.37 24.77,39.37 25.65,40.26 v37.85,40.26 | 29.59,4.19 29.72,4.06
  Top 0.61: 30.55,2.61 POWER.2 | 40.01,35.05 v40.39,35.05 39.5,35.05 | R12.2 39.5,36.58 | R12.2 R13.2 | T_SD.2 39.09,35.05 39.5,35.05 | 44.96,32.89 v44.96,31.62 44.6,31.26 C20.1 42.82,31.26 42.16,30.61 41.02,30.61 40.01,29.59 40.01,28.7 35.31,24 29.21,24 28.7,23.5 25.53,23.5 v24.26,22.23 | R12.2 39.5,35.05
  Top 0.813: 30.55,2.61 30.55,3.23 29.72,4.06 29.38,4.4 D2.C 29.38,7.67 R1.2 27.77,10.16 v27.69,10.41 | U$9.P$3 11.92,9 13.72,10.79 15.49,10.79 16.89,12.19 18.16,12.19 19.68,13.72 v22.23,13.72
  Bottom 0.305: v40.39,46.74 42.42,44.7 42.42,40.01 41.91,39.5 40.39,39.5 39.62,40.26 v37.85,40.26 | CN2.1 63.47,20.54 63.12,20.19 56.64,20.19 55.5,21.34 v54.74,21.34
  Bottom 0.61: 30.55,3.5 30.55,2.61 POWER.2 | v44.96,31.62 41.53,35.05 v40.39,35.05
  Bottom 0.813: POWER.4 35.56,3.56 34.8,4.32 31.37,4.32 30.55,3.5 | v27.69,10.41 27.69,10.16 26.8,9.27 23.24,9.27 22.23,10.29 v22.23,13.72 22.23,13.97 24.26,16 v24.26,22.23
+5_PSU  (via drill 0.61)
  Top 0.406: U$3.8 35.31,14.8 35.31,14.73
  Top 0.813: 35.31,14.73 36.89,14.73 C_CO3.1 39.72,15.79 L1.P$1 | 43.56,11.19 43.66,11.18 43.66,11.19 L1.P$1 | L1.P$1 42.02,8.38 C_CO1.1 41.97,7.55 41.02,6.6 38.86,6.6 v38.1,7.37
  Bottom 0.813: U$9.P$6 15.6,6.5 17.27,4.83 20.95,4.83 23.24,7.11 28.19,7.11 28.96,7.87 37.59,7.87 v38.1,7.37
+5V  (via drill 0.61)
  Top 0.61: v29.46,37.72 29.46,35.05 | 29.46,35.05 29.46,32.51 28.19,31.24 IC6.7 | IC6.4 29.46,35.05 | v63.88,12.57 64.64,12.57 67.31,15.24 67.31,24.13 67.82,24.64 67.82,28.83 ICSP.2 | 38.1,2.92 39.75,4.57 50.04,4.57 v58.04,12.57
  Top 0.813: POWER.5 38.1,2.92 | U$9.P$4 12.09,4.83 24.26,4.83 v24.64,4.45
  Bottom 0.61: ICSP.2 66.17,31.37 60.45,37.08 53.72,37.08 51.69,39.12 48.64,39.12 48.01,39.75 44.2,39.75 43.18,38.73 30.48,38.73 v29.46,37.72 | v58.04,12.57 v63.88,12.57
  Bottom 0.813: v24.64,4.45 29.46,4.45 30.48,5.46 35.81,5.46 38.1,3.17 POWER.5
+12V  (via drill 0.61)
  Top 0.305: 12.19,16.76 12.19,20.95 12.7,21.46 VDIV3.2 13.72,21.46 14.1,21.08 U1.4 | U$3.4 31.04,20.12
  Top 0.61: R5.1 31.24,21.59 U$3.4
  Top 0.813: U$6.P$4 3.28,16.49 v4.06,17.27 4.85,16.49 U$6.P$3 7.85,16.76 12.19,16.76 15.11,16.76 15.62,17.27 17.65,17.27 19.43,15.49 21.46,15.49 21.97,16 21.97,17.53 22.73,18.29 23.75,18.29 25.02,19.56 C_VC1.2 30.48,19.56 31.04,20.12
  Bottom 0.813: 45.72,2.67 POWER.8 45.72,2.79 42.67,5.84 37.47,5.84 36.7,6.6 29.59,6.6 28.83,5.84 23.88,5.84 21.72,3.68 16.64,3.68 15.49,4.83 12.83,4.83 10.92,2.92 9.27,2.92 8.38,3.81 8.38,12.95 v4.06,17.27
GND  (via drill 0.61)
  Top 0.254: IC2.42 48.72,27.51 45.78,24.57 | 54.17,26.97 C23.1 C24.1 | IC2.5 54.45,35.24 C21.2 54.83,34.32 55.82,33.34 v56.4,33.34 | 45.78,24.57 44.83,23.62 C8.2 | C19.2 47.37,22.99 45.78,24.57 | IC2.18 49.22,42.94 C3.1
  Top 0.305: POWER.6 POWER.7 | IC2.35 44.07,33.74 C20.2 | IC6.5 24.77,33.78 24.51,33.53 23.11,33.53 21.97,34.67 | IC6.1 25.53,38.86 24.89,38.23 23.62,38.23 22.86,37.47 22.86,35.56 21.97,34.67 | 21.97,34.67 v21.46,34.67 | U1.1 16.33,19.89 15.27,18.82 v14.88,18.8 | VDIV1.1 20.19,20.32 20.19,23.14 v19.84,23.5 | RESET.2 20.99,9.87
  Top 0.406: IC6.12 34.29,33.78 CAGND.2 | 20.99,2.32 RESET.1 | v20.85,43.56 21.4,43.01 U2.3
  Top 0.61: CDC2.2 CFCAP.2 | U$1.2 C6.1 | R8.1 22.1,44.81 v20.85,43.56
  Top 0.813: U$3.5 31.24,16.26 32,17.02 U$3.P$1 33.19,17.69 C_CO3.2 | C_CO1.2 40.07,9.21 38.04,11.24 C_CO2.1
  other vias: 64.52,41.66 53.98,6.35 63.22,47.52 52.07,44.45 63.72,10.22 4.47,51.69 53.72,18.03 41.27,21.97 27.71,44.83 37.95,12.98 57.25,28.6 19.56,26.54 17.91,26.54 59.91,5.27 23.46,26.61 1.55,34.29 4.54,9.46 24.28,40.64 36.86,41.78 3.96,14.86 12.73,23.24 29.92,16.13 30.51,18.03 36.35,19.18 35.97,16.26 47.09,15.01 51.92,20.22 58.19,23.5 35.46,25.91 17.93,23.5 60.43,39.14 66.13,4.76 8.15,31.62 17.42,44.32 56.39,16.13 51.18,15.24 57.4,18.41 47.52,8.26 51.18,12.45 57.78,10.03 54.1,12.7 50.8,9.4 40.49,27.08 37.74,36.7 41.92,32.19 50.14,33.93 46.58,34.32 50.65,37.24 34.06,46.86 17.17,15.88 21.62,7.62 16.54,1.27 1.55,4.57 11.58,48.77 17.17,48.77 58.39,35.2 34.63,29.27 29.62,20.95
  pour Bottom (isolate 0.254, rank 2): -3.85,56.39 76.07,55.88 71.12,-1.4 -4.68,-1.27
  pour Top (isolate 0.305, rank 2): -3.43,55.73 73.46,54.73 73.45,-2.54 -4.45,-2.54
N$1
  Top 0.305: LED1.C 8.54,1.65 R6.1
N$2
  Top 0.406: IC5.2 33.27,44.32 32.18,43.23 Y1.P$4
N$3
  Top 0.406: IC5.1 33.02,45.59 32.18,46.43 Y1.P$1
N$4
  Top 0.305: IC6.15 34.16,37.59 CFCAP.1
N$5
  Top 0.406: IC6.11 34.04,32.51 CAGND.1
N$6
  Top 0.813: U$3.2 C_BST.1
N$7
  Top 0.813: U$3.6 C_UP.2 R-UP.1 30.48,12.57 29.59,13.46 R_DN.2
N$8
  Top 0.61: R5.2 U$3.3
N$9  (via drill 0.61)
  Top 0.813: v13.21,37.34 K2.7 11.68,40.59 K1.5 | R7.1 21.18,36.7 19.56,36.7 v18.92,37.34 | SJ2.2 4.32,34.42 v5.84,32.89
  Bottom 0.813: v5.84,32.89 7.75,32.89 12.32,37.34 v13.21,37.34 v18.92,37.34
N$10
  Top 0.254: IC2.6 55.95,35.74 56.74,34.96 C21.1 57.2,34.86 58.04,34.04 58.35,33.73 L6.1
N$11
  Top 0.406: 7.87,34.54 SJ1.2
  Top 0.61: CDIV1.1 CRES.2
  Top 0.813: K1.7 18.29,39.42 K2.5 17.27,38.05 17.27,36.07 | CRES.2 21.59,32.51 21.34,32.51 19.05,34.8 18.67,34.8 17.4,36.07 17.27,36.07 | 7.87,34.54 9.53,34.54 | 9.53,34.54 9.65,34.54 10.92,35.81 15.24,35.81 15.49,36.07 17.27,36.07 | VAR_C.P$2 11.56,30.1 9.53,32.13 9.53,34.54
N$12
  Top 0.61: IC6.6 25.12,32.51 CRES.1 23.75,31.88 22.86,30.99 22.86,28.07 22.35,27.56 20.45,27.56 19.81,28.19 19.81,28.96 18.82,29.94 VAR_C.P$1
N$13
  Top 0.61: IC6.8 25,29.97 CDIV1.2
  Top 1.016: CDIV2.1 26.01,27.81 CDIV1.2
N$14  (via drill 0.61)  (1 unrouted)
  Top 0.813: SJ1.1 7.45,37.54 7.45,39.77 ANT1.P$1 7.98,40.16 v9.27,38.86 | K1.8 18.54,41.7 v17.4,42.8
  Bottom 0.813: v17.4,42.8 13.72,39.12 9.53,39.12 v9.27,38.86
N$15
  Top 0.305: U1.5 U1.6 13.97,20.07 13.84,19.94 13.59,19.94 VDIV3.1 13.59,19.68
N$16  (1 unrouted)
  Top 0.813: ANT2.P$2 3.94,44.78 3.94,43.43 5.71,41.66 9.4,41.66 9.91,41.15 9.91,40.26 10.67,39.5 K2.8
N$17
  Top 0.305: IC6.16 34.04,38.86 CDC2.1
  Top 0.406: 34.29,38.92 CDC2.1
N$18
  Top 0.406: IC6.9 33.33,30.03 CDEC.2
N$19
  Top 0.406: CDEC.1 31.37,28.32 30.23,29.46 30.23,30.48 30.99,31.24 IC6.10
N$20
  Top 0.813: IC6.3 24.92,36.32 R7.2
N$21
  Top 0.305: U1.3 17.53,21.08 18.16,20.45 18.16,19.56 19.05,18.67 VDIV2.2
  Top 0.61: D1.C 19.3,17.93 VDIV2.2
N$22  (via drill 0.61)
  Top 0.61: K2.4 16.72,31.5 14.78,31.5 K2.2 13.21,33.02 v12.19,32 | v20.7,45.59 21.84,46.74 R8.2 | 21.59,46.74 R8.2 | K1.4 13,48.26 15.45,48.26 K1.2 17.35,46.94 18.67,48.26 20.19,48.26 20.7,47.75 21.08,47.75 R8.2
  Bottom 0.61: v12.19,32 12.19,32.38 15.88,36.07 17.27,36.07 17.91,35.43 19.18,35.43 20.7,36.96 20.7,40.89 19.56,42.04 19.56,44.45 v20.7,45.59
N$26
  Top 0.813: U$3.7 33.78,13.12 L2.1
N$27
  Top 0.813: L1.P$2 41.92,19.04 38.86,22.1 C_BST.2 35.56,20.63 U$3.1
N$30  (1 unrouted)
  Top 0.813: K2.6 15.75,39.5 15.49,39.75 15.49,42.8 13.21,45.09 11.05,45.09 10.16,45.97 10.16,48.64 8.53,50.27 ANT2.P$3
N$32
  Top 0.406: U2.4 20.45,40.3 20.45,42.29 18.67,44.07 18.67,44.84 18.05,45.47 | K1.3 15.7,45.47 18.05,45.47 | K1.1 19.3,46.72 18.05,45.47
N$35  (1 unrouted)
  Top 0.813: ANT1.P$4 1.93,43.16 4.32,40.77 SJ2.1 | K1.6 12.01,43.16 ANT1.P$3
PA00_XIN32
  Top 0.254: IC2.1 53.26,33.23 53.26,30.8 Y4.P$1 53.06,29.24 C23.2
PA01_XOUT32
  Top 0.254: IC2.2 53.76,33.74 56.23,31.27 Y4.P$2 56.16,29.11 C24.2
PA02_AIN0  (via drill 0.61 pad 0.25)
  Top 0.254: IC2.3 54.02,34.24 56.26,32 59.31,32 59.31,9.65 54.36,4.7 52.7,4.7 50.8,2.79 AD.1
  Top 0.305: VDIV_USB.1 VDIV1.2 | VDIV2.1 VDIV1.2 | v22.35,19.56 21.59,20.32 VDIV1.2
  Bottom 0.305: v22.35,19.56 21.08,18.29 21.08,9.91 22.73,8.26 27.69,8.26 28.19,8.76 38.35,8.76 40.26,6.86 43.18,6.86 45.85,4.19 46.23,4.19 47.88,2.54 AD.1
PA03_AREFA
  Top 0.254: IC2.4 52.38,34.74 52.07,35.05 52.07,38.73 55.04,41.7 C5.+ 57.39,41.4 C4.1 64.77,47.15 64.77,51.69 63.63,52.83 25.91,52.83 IOH.8
  Bottom 0.305: IOH.8 23.92,50.76
PA04_AIN4
  Top 0.254: IC2.9 59.28,37.24 60.83,35.69 60.83,8.51 58.42,6.1 AD.4
  Top 0.305: AD.4 58.37,2.59
PA05_AIN5
  Top 0.254: IC2.10 59.54,37.74 61.34,35.94 61.34,2.92 AD.5
PA06_AIN6  (via drill 0.61)
  Top 0.305: v55.75,38.73 55.31,38.29 55.26,38.24 IC2.11
  Bottom 0.305: IOH.1 41.78,50.8 43.69,48.9 45.59,48.9 53.98,40.51 54.74,40.51 55.5,39.75 55.5,38.99 v55.75,38.73
PA7_RF_SWTICH  (via drill 0.61)
  Top 0.254: IC2.12 53.6,38.74 v54.23,39.37
  Top 0.406: K2.1 12.24,34.67 13.97,34.67 | 13.97,34.67 v16.51,34.67 | U2.2 22.35,43.05 v22.99,43.69 | K2.3 15.75,32.89 13.97,34.67
  Bottom 0.305: 39.12,49.28 42.42,49.28 43.43,48.26 45.34,48.26 v54.23,39.37 | 39.12,49.28 39.12,48.77 38.35,48.01 37.34,48.01 36.7,48.64 25.78,48.64 24.64,47.5 24.64,46.99 23.88,46.23 23.88,44.58 v22.99,43.69 | 39.12,49.28 IOH.2
  Bottom 0.406: v16.51,34.67 17.02,34.16 19.3,34.16 21.72,36.58 21.72,38.48 22.99,39.75 v22.99,43.69
PA08_TCC0-W0_PA8
  Top 0.254: IC2.13 51.82,40.27 54.99,43.43 54.99,48.64 55.63,49.28 56.9,49.28 IOL.3
PA09_TCC0-W1_PA9
  Top 0.254: IC2.14 51.22,40.81 51.44,41.02 51.82,41.02 54.36,43.56 54.36,48.9 55.88,50.42 IOL.4
PA10_TCC0-W2_PA10
  Top 0.254: IC2.15 50.72,41.07 51.31,41.66 51.69,41.66 53.85,43.81 53.85,49.15 54.61,49.91 54.61,51.44 55.5,52.32 59.44,52.32 IOL.2
  Bottom 0.305: 60.91,50.74 IOL.2
PA11_TCC0-W3_PA11
  Top 0.254: IC2.16 50.22,39.44 50.55,39.12 51.69,39.12 52.58,40.01 52.58,40.26 55.63,43.31 55.63,48.39 56.01,48.77 57.28,48.77 57.78,49.28 61.98,49.28 IOL.1
  Bottom 0.305: 63.57,50.73 IOL.1
PA13
  Top 0.254: IC2.22 47.22,39.6 46.86,39.24 46.1,39.24 45.72,39.62 IOL.8
PA14_TCC0-W4
  Top 0.254: IC2.23 46.72,45.96 49.91,49.15 51.69,49.15 IOL.5
PA15_TCC0-W5
  Top 0.254: IC2.24 46.2,40.28 46.2,46.2 IOL.6
PA16_MOSI
  Top 0.305: IC2.25 44.7,47.38 42.93,49.15 42.93,51.69 42.29,52.32 35.56,52.32 IOH.4
PA17_SCK  (via drill 0.61)
  Top 0.254: IC2.26 44.69,38.23 | 44.68,38.23 IC2.26 | v37.85,49.15 38.1,48.9 42.29,48.9 44.07,47.12 44.07,39.5 43.69,39.12 43.69,38.73 44.18,38.24 IC2.26
  Bottom 0.305: v37.85,49.15 37.72,49.28 30.48,49.28 IOH.6
PA18_SS
  Top 0.254: IC2.27 43.92,37.74 43.18,38.48 43.18,39.5 43.56,39.88 43.56,46.86 42.16,48.26 38.61,48.26 38.35,48.01 37.34,48.01 36.58,48.77 IOH.3
  Bottom 0.254: 36.53,50.75 IOH.3
PA19_MISO
  Top 0.254: IOH.5 31.5,50.04 32.26,49.28 35.18,49.28 37.08,47.37 38.73,47.37 38.99,47.62 42.04,47.62 43.05,46.61 43.05,40.13 42.67,39.75 42.67,38.23 43.66,37.24 IC2.28
PA20_TCC0-W6
  Top 0.254: IC2.29 44.71,36.73 45.44,36.73 45.72,37.01 45.72,38.86 45.21,39.37 45.21,47.62 44.45,48.39 44.45,51.56 45.21,52.32 46.74,52.32 IOL.7
PA21_INT&SDCS  (via drill 0.61 pad 0.61)
  Top 0.254: IC2.30 43.9,36.24 42.16,37.97 42.16,40.39 42.55,40.77 42.55,43.81 R9.1
  Top 0.305: v38.23,44.32 IC5.7
  Top 0.406: R9.1 IC5.7
  Bottom 0.305: 25.99,32.05 U$4.1 24.6,32.05 22.61,34.04 22.61,37.59 23.62,38.61 28.07,38.61 29.46,40.01 33.15,40.01 37.47,44.32 v38.23,44.32
PA22_SDA  (via drill 0.61)
  Top 0.254: IC2.31 43.63,35.74 41.4,37.97 R13.1 41.27,40.64 v41.15,40.51 40.06,41.47 IC5.5 | 33.66,48.64 32,48.64 31.37,49.28 22.86,49.28 IOH.9
  Top 0.305: v37.97,46.35 37.21,46.35 34.92,48.64 33.66,48.64
  Bottom 0.254: v41.15,40.51 41.15,43.18 v37.97,46.35
PA23_SCL
  Top 0.254: IOH.10 20.95,48.64 30.99,48.64 31.62,48.01 34.67,48.01 37.34,45.34 37.34,43.69 38.23,42.8 | 38.23,42.8 38.23,41.66 40.39,39.5 40.39,37.59 R12.1 41.91,36.7 43.37,35.24 IC2.32 | IC5.6 38.48,43.05 38.23,42.8
PA27_TX_LED  (via drill 0.61)
  Top 0.305: IC2.39 47.22,28.42 45.34,26.54 42.42,26.54 41.66,25.78 38.48,25.78 35.81,23.11 29.59,23.11 29.08,22.61 26.67,22.61 26.16,22.61 24.64,21.08 23.5,21.08 v22.61,21.97 | v9.91,4.45 10.67,3.68 R6.2
  Bottom 0.305: v9.91,4.45 10.54,4.45 12.57,6.48 12.57,9.53 19.68,16.64 19.68,19.05 v22.61,21.97
PA28_2FETS  (via drill 0.61)
  Top 0.305: IC2.41 48.22,27.77 44.96,24.51 39.88,24.51 | v36.96,31.24 38.42,32.96 T_SD.1 | U1.2 17.02,20.57 17.4,20.19 17.4,18.67 v17.02,18.92 | 39.88,24.51 39.24,24.51 v38.99,24.77 | R10.2 39.75,24.38 39.88,24.51
  Bottom 0.305: v38.99,24.77 38.1,23.37 22.1,23.37 v17.02,18.92
  Bottom 0.406: v36.96,31.24 36.96,26.8 v38.99,24.77
PA30_SWCLK  (via drill 0.61)
  Top 0.254: IC2.45 50.22,25.34
  Top 0.305: 50.22,25.34 51.56,24 v52.83,24
  Bottom 0.305: CN2.4 66.26,19.27 66.67,19.68 66.67,21.34 65.53,22.48 63.5,22.48 62.48,21.46 57.15,21.46 54.61,24 v52.83,24
PA31_SWDIO  (via drill 0.61)
  Top 0.254: IC2.46 50.72,26.37 51.94,25.15
  Top 0.305: 51.94,25.15 53.47,25.15 54.36,24.26 v54.1,22.86
  Bottom 0.305: CN2.2 65.53,20.95 64.77,21.72 63.63,21.72 62.74,20.83 56.9,20.83 54.86,22.86 v54.1,22.86
PB02  (via drill 0.61)
  Top 0.254: IC2.47 51.22,26.89 52.32,25.78 54.36,25.78 v55.75,24.38 | v62.61,23.37 61.85,22.61 61.85,4.19 AD.6
  Bottom 0.254: v55.75,24.38 55.75,23.75 57.4,22.1 61.34,22.1 v62.61,23.37
PB03_RFIDIN  (via drill 0.61)
  Top 0.305: IC2.48 51.72,34.39 51.05,35.05 v51.05,35.56 | IC6.13 33.02,35.05 33.78,35.81 v34.42,35.81
  Bottom 0.305: v34.42,35.81 35.18,35.05 38.61,35.05 39.75,36.2 50.42,36.2 v51.05,35.56
PB08_AIN2
  Top 0.254: IC2.7 58.75,36.24 59.82,35.18 59.82,9.27 53.34,2.79 AD.2
  Top 0.305: AD.2 53.37,2.56
PB09_AIN3
  Top 0.254: IC2.8 59.02,36.74 60.33,35.43 60.33,8.89 55.88,4.45 AD.3
PB10_S4_SPI_MOSI  (via drill 0.61)
  Top 0.305: v47.12,38.23 47.62,38.23 48.72,39.32 IC2.19
  Bottom 0.305: 27.35,29.55 U$4.2 28.53,29.55 32.77,33.78 32.77,35.69 34.92,37.85 43.56,37.85 44.58,38.86 46.35,38.86 46.99,38.23 v47.12,38.23 51.18,38.23 53.21,36.2 59.82,36.2 64.9,31.11 64.9,29.84 66.17,28.57 ICSP.4
PB11_S4_SPI_SCK  (via drill 0.61)
  Top 0.254: IC2.20 48.22,41.26 47.8,41.68 47.8,45.11 48.92,46.23 v52.07,46.23 | 62.48,36.83 62.48,29.08 ICSP.3
  Top 0.305: 62.48,36.83 61.98,37.34 v61.98,42.04
  Bottom 0.305: v61.98,42.04 57.78,46.23 v52.07,46.23
  Bottom 0.406: ICSP.3 59.05,27.94 57.02,25.91 47.12,25.91 41.86,20.65 40.31,20.65 38.99,21.97 U$4.5
PB12_S4_SPI_MISO  (via drill 0.61)
  Top 0.254: IC2.21 47.72,40.92 47.28,41.36 47.28,45.69 49.34,47.75 v52.07,47.75 | 63.12,30.99 ICSP.1
  Top 0.305: 63.12,30.99 63.12,37.21 62.74,37.59 62.74,40.39 63.12,40.77 v63.12,43.81
  Bottom 0.254: 63.12,43.94 v63.12,43.81
  Bottom 0.305: v52.07,47.75 59.18,47.75 v63.12,43.81 | U$4.7 39.14,17.05 47.37,25.27 57.28,25.27 59.18,27.18 62.36,27.18 62.87,26.67 64.26,26.67 64.9,27.3 64.9,28.96 63.63,30.23 ICSP.1
PB22_DEBUG_TX
  Top 0.305: IC2.37 46.22,31.23 45.21,30.23 43.81,30.23 JP1.2
PB23_DEBUG_RX
  Top 0.305: IC2.38 46.72,30.59 JP1.1
RESET  (via drill 0.61)
  Top 0.305: RESET.4 25.91,10.01 | 25.91,2.54 25.49,2.12 RESET.3
  Top 0.406: R2.2 43.05,23.5 | RESET.3 26.75,0.76 31.24,0.76 POWER.3 | 25.91,2.54 25.91,2.92 26.92,3.94 26.92,8.99 25.91,10.01
  Top 0.61: 33.02,5.82 D2.A | D2.A 32.78,7.09 31.77,8.11 R1.1 | POWER.3 33.02,5.58 D2.A | D2.A 33.14,5.46 49.66,5.46 56.77,12.57 56.77,14.35 | 43.05,23.5 43.05,23.11 44.7,21.46 47.37,21.46 54.48,14.35 56.77,14.35 | 56.77,14.35 v58.04,14.35
  Bottom 0.406: ICSP.5 63.75,25.27 63.75,24.64 64.52,23.88 65.15,23.88 67.31,21.59 67.31,16.13 66.64,15.46 CN2.10 65.53,15.02 64.86,14.35 v58.04,14.35
TARGET_RESET
  Top 0.305: R2.1 C8.1 45.09,25.4 47.72,28.04 IC2.40
TARGET_USB_N
  Top 0.254: U$5.D- 9.52,25.4 14.22,25.4 | 14.22,25.4 26.04,25.4 arc47 37.21,29.72 40.64,33.53 arc-54 42.67,34.74 IC2.33 | Z6.1 14.22,26.45 14.22,25.4
TARGET_USB_P
  Top 0.254: IC2.34 IC2.34 arc90 IC2.34 | 44.62,34.24 IC2.34 | U$5.D+ 14.22,24.64 | 14.22,24.64 26.92,24.64 arc50 38.23,29.72 41.27,33.15 arc-58 43.56,34.24 IC2.34 | Z5.1 14.22,23.58 14.22,24.64
VBAT1  (via drill 0.61)  (1 unrouted)
  Top 0.254: IC5.3 33.72,42.99
  Top 0.406: 33.72,42.99 32.38,41.66 24.89,41.66 24.26,42.29 24.26,44.07 23.5,44.83 v23.5,47.5
  Bottom 0.61: G1.+@1 17.39,47.5 v23.5,47.5
VDD  (via drill 0.61)
  Top 0.61: T_SD.3 35.69,33.48 35.69,32 34.67,30.99 v34.42,30.99
  Bottom 0.61: v34.42,30.99 33.91,30.35 28.1,24.55 U$4.4
VDDCORE
  Top 0.254: IC2.43 49.22,27 47.37,25.14 C19.1
X3.3V
  Top 0.61: 10.5,13.72 C2.2 | C2.2 10.59,13.66 10.72,13.54 U$1.5 | U$9.P$1 6.41,10.48 7.62,11.68 9.14,11.68 C2.2
XUSB  (via drill 0.61)
  Top 0.305: VDIV_USB.2 19.18,22.1 v17.02,22.1
  Top 0.406: U$5.VBUS 11,26.24 v11.3,26.54 11.35,26.49 C26.1
  Top 0.508: v11.3,26.54 11.72,26.57
  Top 0.61: 14.73,13.34 14.63,13.34 U$1.1 | U$1.1 15.16,13.34 17.65,13.34 18.29,13.97 C6.2 | U$1.3 14.02,15.42 13.59,14.99 13.59,13.97 14.02,13.54 U$1.1
  Top 0.813: U$9.P$2 8.38,8.46 8.38,9.53 9.65,10.79 10.29,10.79 v11.05,11.56 12.19,11.56 12.83,12.19 13.59,12.19 14.73,13.34
  Bottom 0.305: v17.02,22.1 11.68,22.1 11.43,21.84
  Bottom 0.61: v11.3,26.54 11.43,25.78 11.43,21.84 11.43,11.94 v11.05,11.56

### Text on the board
tPlace: SCL | PA23 | SDA | PA22 | AREF | PA17 | MOSI | GPIO3 | PA03 | GND | SCK | MISO | PA16 | SS | PA18 | PA7 | PA6 | PA13 | PA20 | PA15 | PA14 | PA9 | PA8 | PA10 | PA11 | PA10 | GPIO2 | IOREF | RESET | 3V3 | 5V | GND | VIN | PA2 | PB08 | PB09 | PB04 | PB05 | PB02 | USB | BAT
tNames: 1
214bmp: D:/SmartProjects/Snc/a4_bn_logo2.bmp